# EAGLE design column_controller (EAGLE 9.6.0)
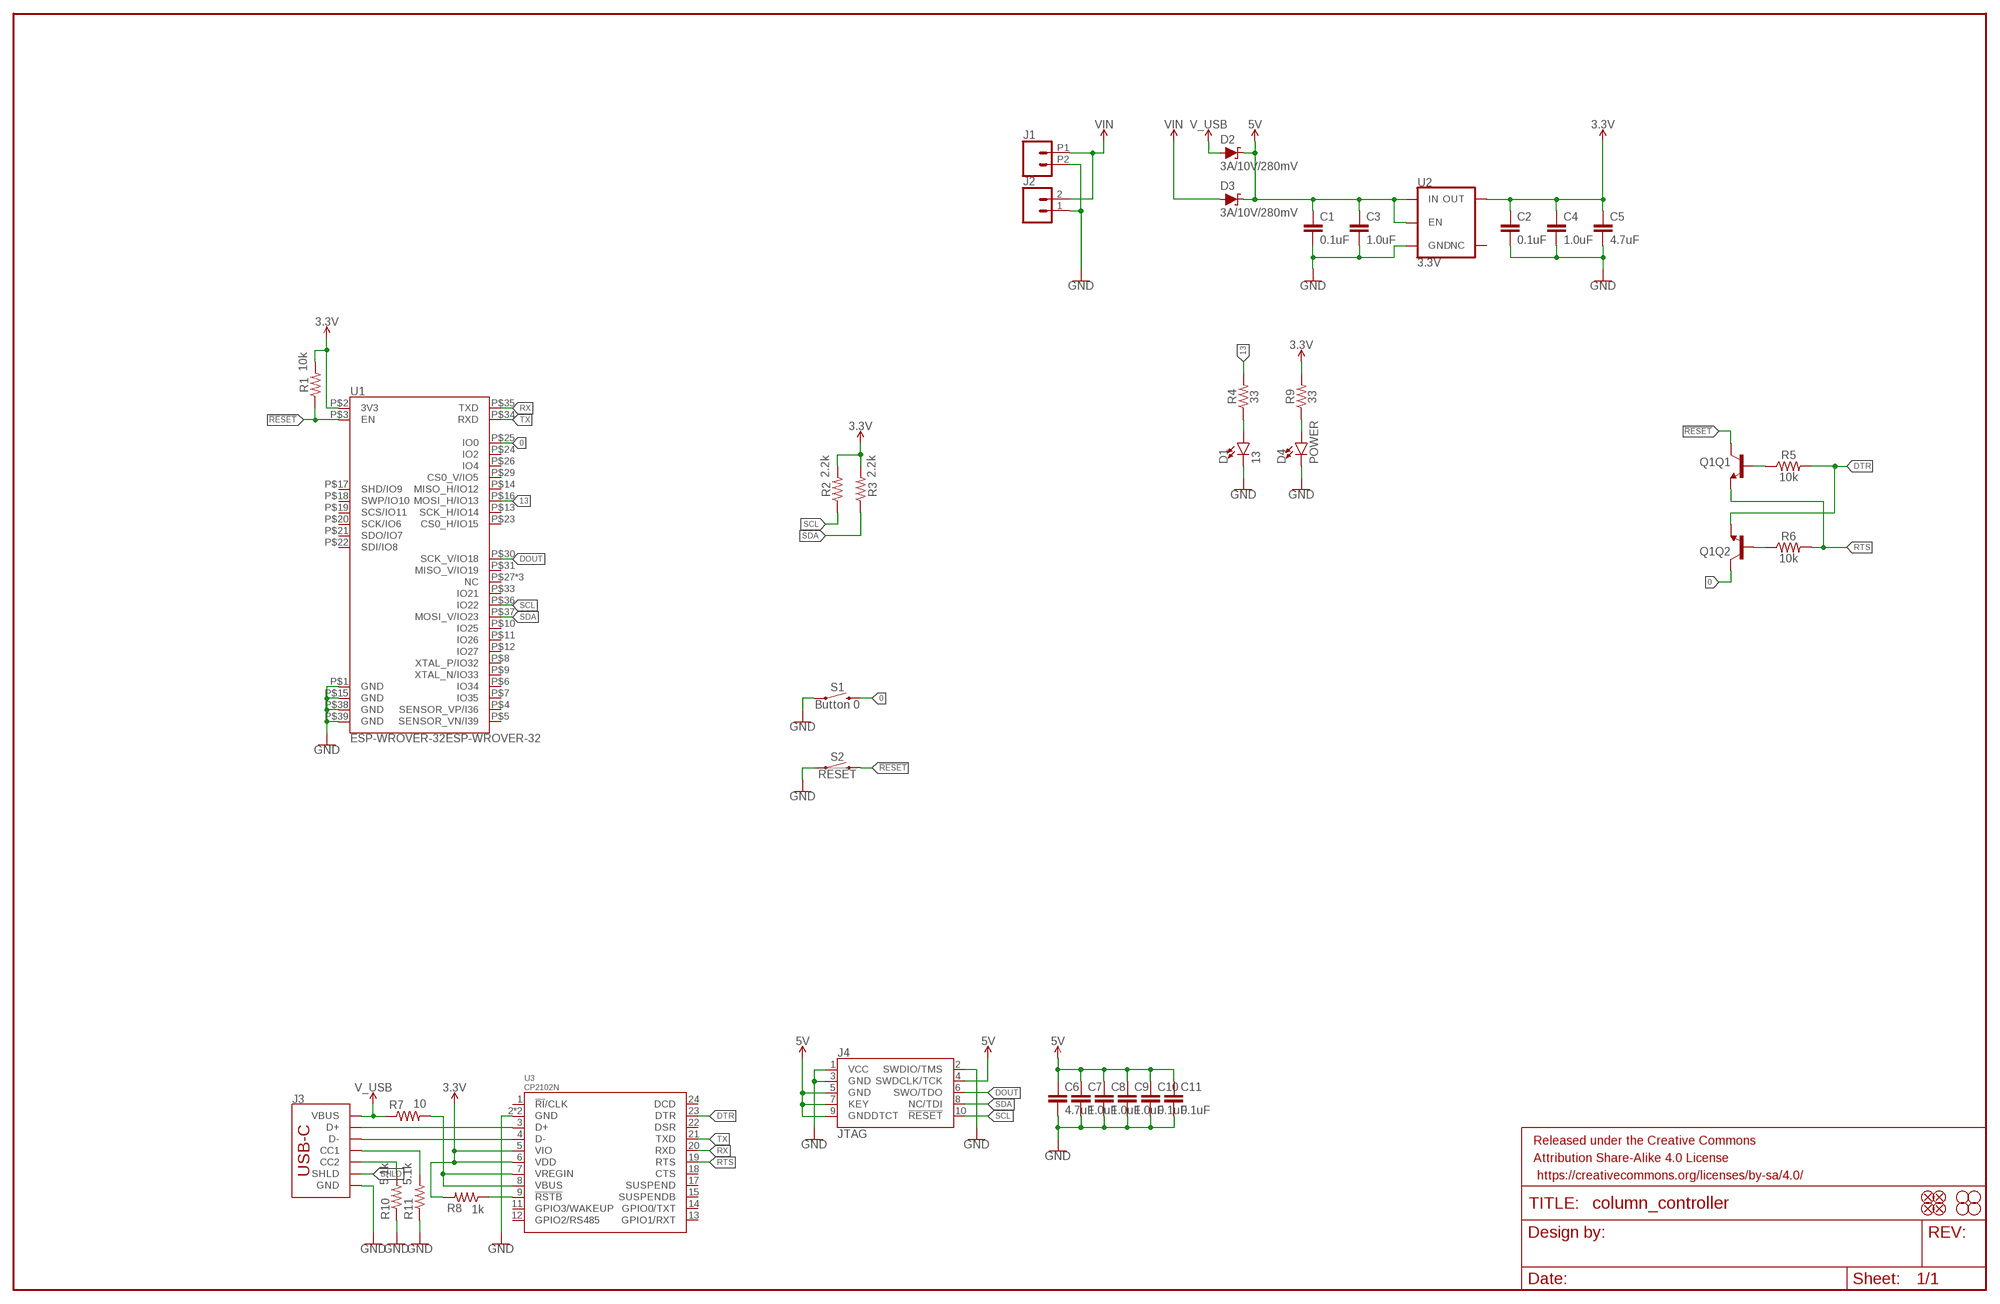
[diagram p0: schematic, sheet 1]

## Parts
C1  0.1uF  0.1UF-0603-25V-(+80/-20%)  [0603]
C2  0.1uF  0.1UF-0603-25V-(+80/-20%)  [0603]
C3  1.0uF  1.0UF-0603-16V-10%-X7R  [0603]
C4  1.0uF  1.0UF-0603-16V-10%-X7R  [0603]
C5  4.7uF  4.7UF-0603-35V-(20%)  [0603]
C6  4.7uF  4.7UF-0603-6.3V-(10%)  [0603]
C7  1.0uF  1.0UF-0603-16V-10%-X7R  [0603]
C8  1.0uF  1.0UF-0603-16V-10%-X7R  [0603]
C9  1.0uF  1.0UF-0603-16V-10%-X7R  [0603]
C10  0.1uF  0.1UF-0603-25V-(+80/-20%)  [0603]
C11  0.1uF  0.1UF-0603-25V-(+80/-20%)  [0603]
D1  13  LED-BLUE0603  [LED-0603]
D2  3A/10V/280mV  DIODE-SCHOTTKY-BAT60A  [SOD-323]
D3  3A/10V/280mV  DIODE-SCHOTTKY-BAT60A  [SOD-323]
D4  POWER  LED-RED0603  [LED-0603]
FD1  FIDUCIAL1X2  [FIDUCIAL-1X2]
FD2  FIDUCIAL1X2  [FIDUCIAL-1X2]
FD3  FIDUCIAL1X2  [FIDUCIAL-1X2]
FD4  FIDUCIAL1X2  [FIDUCIAL-1X2]
FRAME1  FRAME-LEDGER  [CREATIVE_COMMONS]
H1  STAND-OFF  [STAND-OFF]
H2  STAND-OFF  [STAND-OFF]
H3  STAND-OFF  [STAND-OFF]
H4  STAND-OFF  [STAND-OFF]
J1  CONN_02SCREWTERMINAL-6.35MM-2  [1X02_6.35_SCREWTERM]
J2  CONN_021X02_NO_SILK  [1X02_NO_SILK]
J3  USB_C_2-LAYER  [USB-C-16P]
J4  JTAG  CORTEX_JTAG_DEBUG_SMD  [2X5-SMD-1.27MM]
Q1  TRANS_NPN_DUAL-MBT3904DW1T1  [SC70-6]
R1  10k  10KOHM-0603-1/10W-1%  [0603]
R2  2.2k  2.2KOHM-0603-1/10W-1%  [0603]
R3  2.2k  2.2KOHM-0603-1/10W-1%  [0603]
R4  33  33OHM-0603-1/10W-1%  [0603]
R5  10k  10KOHM-0603-1/10W-1%  [0603]
R6  10k  10KOHM-0603-1/10W-1%  [0603]
R7  10  10OHM-0603-1/10W-1%  [0603]
R8  1k  1KOHM-0603-1/10W-1%  [0603]
R9  33  33OHM-0603-1/10W-1%  [0603]
R10  5.1k  5.1KOHM5.1KOHM-0603-1/10W-1%  [0603]
R11  5.1k  5.1KOHM5.1KOHM-0603-1/10W-1%  [0603]
S1  Button 0  MOMENTARY-SWITCH-SPST-SMD-4.6X2.8MM  [TACTILE_SWITCH_SMD_4.6X2.8MM]
S2  !RESET  MOMENTARY-SWITCH-SPST-SMD-4.6X2.8MM  [TACTILE_SWITCH_SMD_4.6X2.8MM]
U1  ESP-WROVER-32ESP-WROVER-32  [ESP-WROVER-32]
U2  3.3V  V_REG_AP2112K-3.3V  [SOT23-5]
U3  CP2102N  [QFN24]

## Nets
0: Q1.6(Q2:C) S1.3 S1.4 U1.P$25(IO0)
3.3V: C2.1 C4.1 C5.1 R1.2 R2.2 R3.2 R8.2 R9.2 U1.P$2(3V3) U2.5(OUT) U3.5(VIO) U3.6(VDD)
5V: C1.1 C3.1 C6.1 C7.1 C8.1 C9.1 C10.1 C11.1 D2.C D3.C J4.4(SWDCLK/TCK) J4.5(GND) J4.7(KEY) J4.9(GNDDTCT) U2.1(IN) U2.3(EN)
13: R4.2 U1.P$16(MOSI_H/IO13)
!RESET: Q1.3(Q1:C) R1.1 S2.3 S2.4 U1.P$3(EN)
DOUT: J4.6(SWO/TDO) U1.P$30(SCK_V/IO18)
DTR: Q1.1(Q2:E) R5.2 U3.23(DTR)
GND: C1.2 C2.2 C3.2 C4.2 C5.2 C6.2 C7.2 C8.2 C9.2 C10.2 C11.2 D1.C D4.C J1.P2 J2.1 J3.GND J3.GND2(GND) J4.1(VCC) J4.2(SWDIO/TMS) J4.3(GND) R10.1 R11.1 S1.1 S1.2 S2.1 S2.2 U1.P$1(GND) U1.P$15(GND) U1.P$38(GND) U1.P$39(GND) U2.2(GND) U3.2(GND) U3.PAD(GND)
N$1: J3.A7(D-) J3.B7(D-) U3.4(D-)
N$2: J3.A6(D+) J3.B6(D+) U3.3(D+)
N$3: Q1.2(Q2:B) R6.1
N$4: D1.A R4.1
N$5: Q1.5(Q1:B) R5.1
N$6: R7.2 U3.7(VREGIN) U3.8(VBUS)
N$7: R8.1 U3.9(!RSTB)
N$8: D4.A R9.1
N$10: J3.A5(CC1) R11.2
N$11: J3.B5(CC2) R10.2
RTS: Q1.4(Q1:E) R6.2 U3.19(RTS)
RX: U1.P$35(TXD) U3.20(RXD)
SCL: J4.10(!RESET) R2.1 U1.P$36(IO22)
SDA: J4.8(NC/TDI) R3.1 U1.P$37(MOSI_V/IO23)
SHLD: J3.SHLD1(SHLD) J3.SHLD2(SHLD) J3.SHLD3(SHLD) J3.SHLD4(SHLD) J3.SHLD5(SHLD) J3.SHLD6(SHLD) J3.SHLD7(SHLD) J3.SHLD8(SHLD)
TX: U1.P$34(RXD) U3.21(TXD)
V_USB: D2.A J3.VBUS1(VBUS) J3.VBUS2(VBUS) R7.1
VIN: D3.A J1.P1 J2.2
Unconnected: U1.P$4(SENSOR_VP/I36) U1.P$5(SENSOR_VN/I39) U1.P$6(IO34) U1.P$7(IO35) U1.P$8(XTAL_P/IO32) U1.P$9(XTAL_N/IO33) U1.P$10(IO25) U1.P$11(IO26) U1.P$12(IO27) U1.P$13(SCK_H/IO14) U1.P$14(MISO_H/IO12) U1.P$17(SHD/IO9) U1.P$18(SWP/IO10) U1.P$19(SCS/IO11) U1.P$20(SCK/IO6) U1.P$21(SDO/IO7) U1.P$22(SDI/IO8) U1.P$23(CS0_H/IO15) U1.P$24(IO2) U1.P$26(IO4) U1.P$27(NC) U1.P$28(NC) U1.P$29(CS0_V/IO5) U1.P$31(MISO_V/IO19) U1.P$32(NC) U1.P$33(IO21) U2.4(NC) U3.1(!RI!/CLK) U3.11(GPIO3/WAKEUP) U3.12(GPIO2/RS485) U3.13(GPIO1/RXT) U3.14(GPIO0/TXT) U3.15(SUSPENDB) U3.17(SUSPEND) U3.18(CTS) U3.22(DSR) U3.24(DCD)

## Library data of the parts
C1 C2 C10 C11 = SparkFun-Capacitors:0.1UF: 0.1µF ceramic capacitors A capacitor is a passive two-terminal electrical component used to store electrical energy temporarily in an electric field.; PROD_ID: CAP-00810
C3 C4 C7-C9 = SparkFun-Capacitors:1.0UF: 1µF ceramic capacitors A capacitor is a passive two-terminal electrical component used to store electrical energy temporarily in an electric field.; PROD_ID: CAP-13930
C5 = SparkFun-Capacitors:4.7UF: 4.7µF ceramic capacitors A capacitor is a passive two-terminal electrical component used to store electrical energy temporarily in an electric field.; PROD_ID: CAP-14106
C6 = SparkFun-Capacitors:4.7UF: 4.7µF ceramic capacitors A capacitor is a passive two-terminal electrical component used to store electrical energy temporarily in an electric field.; PROD_ID: CAP-08280
D1 = SparkFun-LED:LED-BLUE: Blue SMD LED Used in manufacturing of various products at SparkFun Packages: 0603 - SMD 0603 package [Product Link] <http://www.digikey.com/product-detail/en/SMLE12BC7TT86/511-1589-2-ND/1641808> 1206 - SMD1206 package [Product Link] <http://www.digikey.com/product-detail/en/lite-on-inc/LTST-C150TBKT/160-1643-1-ND/573584> SparkFun Products: ESP8266 Thing-Dev Board <https://www.sparkfun.com/products/13711> RedBoard <https://www.sparkfun.com/products/12757>; PROD_ID: DIO-08575; VALUE: BLUE
D2 D3 = SparkFun-DiscreteSemi:DIODE-SCHOTTKY: Schottky diode A Schottky diode is a semiconductor diode which has a low forward voltage drop and a very fast switching action.; PROD_ID: DIO-14072
D4 = SparkFun-LED:LED-RED: Red SMD LED Used in manufacturing of most products at SparkFun Packages: 0603 - SMD 0603 package [Product Link] <http://docs.avagotech.com/docs/AV02-0551EN> 0603 SMART - SMD 0603 SMART package ( more efficient and expensive)[Product Link] <http://www.osram-os.com/Graphics/XPic2/00077099_0.pdf> 1206 - SMD1206 package [Product Link] <https://www.sparkfun.com/datasheets/DevTools/LilyPad/Q150OVS4.pdff> SparkFun Products: Pro Mini 328 -5V <https://www.sparkfun.com/products/821> RedBoard <https://www.sparkfun.com/products/12757> IOIO-OTG <https://www.sparkfun.com/products/13613>; PROD_ID: DIO-00819; VALUE: RED
FD1-FD4 = SparkFun-Aesthetics:FIDUCIAL: Fiducial Alignment Points Point-of-reference for pick-and-place machines and other optical instruments.
FRAME1 = SparkFun-Aesthetics:FRAME-LEDGER: Schematic Frame - Ledger Standard 11x14 US Ledger frame
H1-H4 = SparkFun-Hardware:STAND-OFF: Stand Off Drill holes for mechanically mounting via screws, standoffs, etc. Note: Use the keepout ring to avoid running the screw head into surrounding components. Variant Overviews STAND-OFF - Mechanical footprint for a #4 phillips button head screw. STAND-OFF-TIGHT - Mechanical footprint for a #4 phillips button head screw, Example SparkFun Products Screw - Phillips Head (1/4", 4-40, 10 pack) <https://www.sparkfun.com/products/10453> (PRT-10453) Screw - Phillips Head (1/2", 4-40, 10 pack) <https://www.sparkfun.com/products/10452> (PRT-10452) Screw - Phillips Head (3/4", 4-40, 10 pack) <https://www.sparkfun.com/products/10451> (PRT-10451) Screw - Phillips Head (1", 4-40, 10 pack) <https://www.sparkfun.com/products/10450> (PRT-10450)
J1 J2 = SparkFun-Connectors:CONN_02: Multi connection point. Often used as Generic Header-pin footprint for 0.1 inch spaced/style header connections On any of the 0.1 inch spaced packages, you can populate with these: Break Away Headers - Straight <https://www.sparkfun.com/products/116> (PRT-00116) Break Away Male Headers - Right Angle <https://www.sparkfun.com/products/553> (PRT-00553) Female Headers <https://www.sparkfun.com/products/115> (PRT-00115) Break Away Headers - Machine Pin <https://www.sparkfun.com/products/117> (PRT-00117) Break Away Female Headers - Swiss Machine Pin <https://www.sparkfun.com/products/743> (PRT-00743) For SCREWTERMINALS and SPRING TERMINALS visit here: Screw Terimnals on SparkFun.com <https://www.sparkfun.com/search/results?term=Screw+Terminals> (5mm/3.5mm/2.54mm spacing) This device is also useful as a general connection point to wire up your design to another part of your project. Our various solder wires solder well into these plated through hole pads. Hook-Up Wire - Assortment (Stranded, 22 AWG) <https://www.sparkfun.com/products/11375> (PRT-11375) Hook-Up Wire - Assortment (Solid Core, 22 AWG) <https://www.sparkfun.com/products/11367> (PRT-11367) View the entire wire category on our website here <https://www.sparkfun.com/categories/141> Special notes: Molex polarized connector foot print use with: PRT-08233 with associated crimp pins and housings. 2.54_SCREWTERM for use with PRT-10571. 3.5mm Screw Terminal footprints for PRT-08084 5mm Screw Terminal footprints for use with PRT-08432
J3 = SparkFun-Connectors:USB_C: USB Type C 16Pin Connector Super Speed pins not available on the 16-pin purely SMD connector so this part is best for USB 2.0 implementations. D1 and D2 are tied together enabling D+/- no matter which way the cable is plugged into the connector. The two channel configuration pins (CC1/2) are exposed. These are normally connected to ground via 5.1k resistors but can be reconfigured for high current/high power applications.; PROD_ID: CONN-14122
J4 = SparkFun-Connectors:CORTEX_JTAG_DEBUG: Cortex Debug Connector - 10 pin Supports JTAG debug, Serial Wire debug, and Serial Wire Viewer. PTH and SMD connector options available. General Connector Information <http://infocenter.arm.com/help/topic/com.arm.doc.faqs/attached/13634/cortex_debug_connectors.pdf> Products: PTH Connector <http://www.digikey.com/product-detail/en/cnc-tech/3220-10-0100-00/1175-1627-ND/3883661> -via Digi-Key SparkFun PSoc <https://www.sparkfun.com/products/13229> SparkFun T <https://www.sparkfun.com/products/13810>; PROD_ID: CONN-14503
Q1 = SparkFun-DiscreteSemi:TRANS_NPN_DUAL: Dual NPN Transistors in Single Package The MBT3904W1 puts two general purpose 3904 NPN transistors in a single package. Datasheet <http://www.onsemi.com/pub_link/Collateral/MBT3904DW1T1-D.PDF> SparkFun Products: SparkFun ESP32 Thing <https://www.sparkfun.com/products/13907>; PROD_ID: TRANS-13337
R1 R5 R6 = SparkFun-Resistors:10KOHM: 10kΩ resistor A resistor is a passive two-terminal electrical component that implements electrical resistance as a circuit element. Resistors act to reduce current flow, and, at the same time, act to lower voltage levels within circuits. - Wikipedia; PROD_ID: RES-00824
R2 R3 = SparkFun-Resistors:2.2KOHM: 2.2kΩ resistor A resistor is a passive two-terminal electrical component that implements electrical resistance as a circuit element. Resistors act to reduce current flow, and, at the same time, act to lower voltage levels within circuits. - Wikipedia; PROD_ID: RES-08272
R4 R9 = SparkFun-Resistors:33OHM: 33Ω resistor A resistor is a passive two-terminal electrical component that implements electrical resistance as a circuit element. Resistors act to reduce current flow, and, at the same time, act to lower voltage levels within circuits. - Wikipedia; PROD_ID: RES-08270
R7 = SparkFun-Resistors:10OHM: 10Ω resistor A resistor is a passive two-terminal electrical component that implements electrical resistance as a circuit element. Resistors act to reduce current flow, and, at the same time, act to lower voltage levels within circuits. - Wikipedia; PROD_ID: RES-12581
R8 = SparkFun-Resistors:1KOHM: 1kΩ resistor A resistor is a passive two-terminal electrical component that implements electrical resistance as a circuit element. Resistors act to reduce current flow, and, at the same time, act to lower voltage levels within circuits. - Wikipedia; PROD_ID: RES-07856
R10 R11 = SparkFun-Resistors:5.1KOHM; PROD_ID: RES-12083
S1 S2 = SparkFun-Switches:MOMENTARY-SWITCH-SPST: Momentary Switch (Pushbutton) - SPST Normally-open (NO) SPST momentary switches (buttons, pushbuttons). Variants PTH-12MM - 12mm square, through-hole Momentary Pushbutton Switch - 12mm Square <https://www.sparkfun.com/products/9190> (COM-09190) PTH-6.0MM, PTH-6.0MM-KIT - 6.0mm square, through-hole Mini Pushbutton Switch <https://www.sparkfun.com/products/97> (COM-00097) KIT package intended for soldering kit's - only one side of pads' copper is exposed. PTH-RIGHT-ANGLE-KIT - Right-angle, through-hole Right Angle Tactile Button <https://www.sparkfun.com/products/10791> - Used on SparkFun BigTime Watch Kit <https://www.sparkfun.com/products/11734> SMD-12MM - 12mm square, surface-mount Tactile Button - SMD (12mm) <https://www.sparkfun.com/products/12993> (COM-12993) Used on SparkFun PicoBoard <https://www.sparkfun.com/products/11888> SMD-4.5MM - 4.5mm Square Trackball Switch Used on SparkFun Blackberry Trackballer Breakout <https://www.sparkfun.com/products/13169> SMD-4.6MMX2.8MM - 4.60mm x 2.80mm, surface mount Used on SparkFun SAMD21 Mini Breakout <https://www.sparkfun.com/products/13664> SMD-5.2MM, SMD-5.2-REDUNDANT - 5.2mm square, surface-mount Mini Pushbutton Switch - SMD <https://www.sparkfun.com/products/8720> (COM-08720) Used on Arduino Pro Mini <https://www.sparkfun.com/products/11114> REDUNDANT package connects both switch circuits together SMD-6.0X3.5MM - 6.0 x 3.5mm, surface mount Momentary Reset Switch SMD <https://www.sparkfun.com/products/8229> (COM-08229) SMD-6.2MM-TALL - 6.2mm square, surface mount Tactile Button - SMD (6mm) <https://www.sparkfun.com/products/12992> Used on SparkFun Digital Sandbox <https://www.sparkfun.com/products/12651> SMD-RIGHT-ANGLE - Right-angle, surface mount Used on SparkFun Block for Intel® Edison - Arduino <https://www.sparkfun.com/products/13036>; PROD_ID: SWCH-13065
U1 = SparkFun-RF:ESP-WROVER-32
U2 = SparkFun-IC-Power:V_REG_AP2112: AP2112 - 600mA CMOS LDO Regulator w/ Enable The AP2112 is CMOS process low dropout linear regulator with enable function, the regulator delivers a guaranteed 600mA (min.) continuous load current. Features Output Voltage Accuracy: ±1.5% Output Current: 600mA (Min.) Foldback Short Current Protection: 50mA Enable Function to Turn ON/OFF VOUT Low Dropout Voltage (3.3V): 250mV (Typ.) @IOUT=600mA Excellent Load Regulation: 0.2%/A (Typ.) Excellent Line Regulation: 0.02%/V (Typ.) Low Quiescent Current: 55μA (Typ.) Low Standby Current: 0.01μA (Typ.) Low Output Noise: 50μVRMS PSRR: 100Hz -65dB, 1kHz -65dB OTSD Protection Stable with 1.0μF Flexible Cap: Ceramic, Tantalum and Aluminum Electrolytic Operation Temperature Range: -40°C to 85°C ESD: MM 400V, HBM 4000V; PROD_ID: VREG-12457
U3 = SparkFun-IC-Comms:CP2102N; PROD_ID: IC-14020

## Board
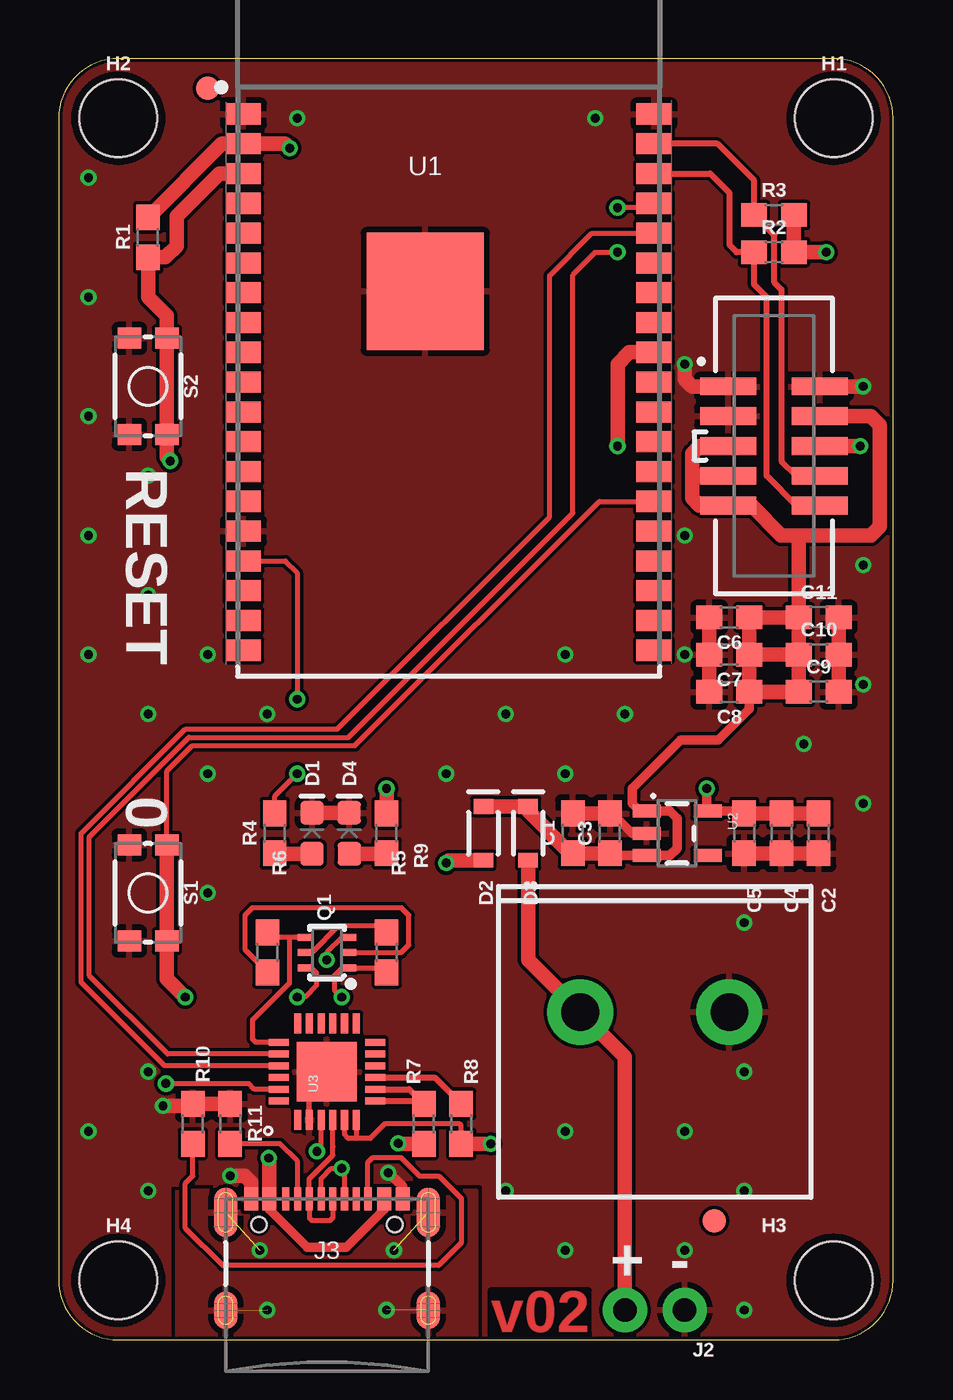
[diagram p1: board, top side]
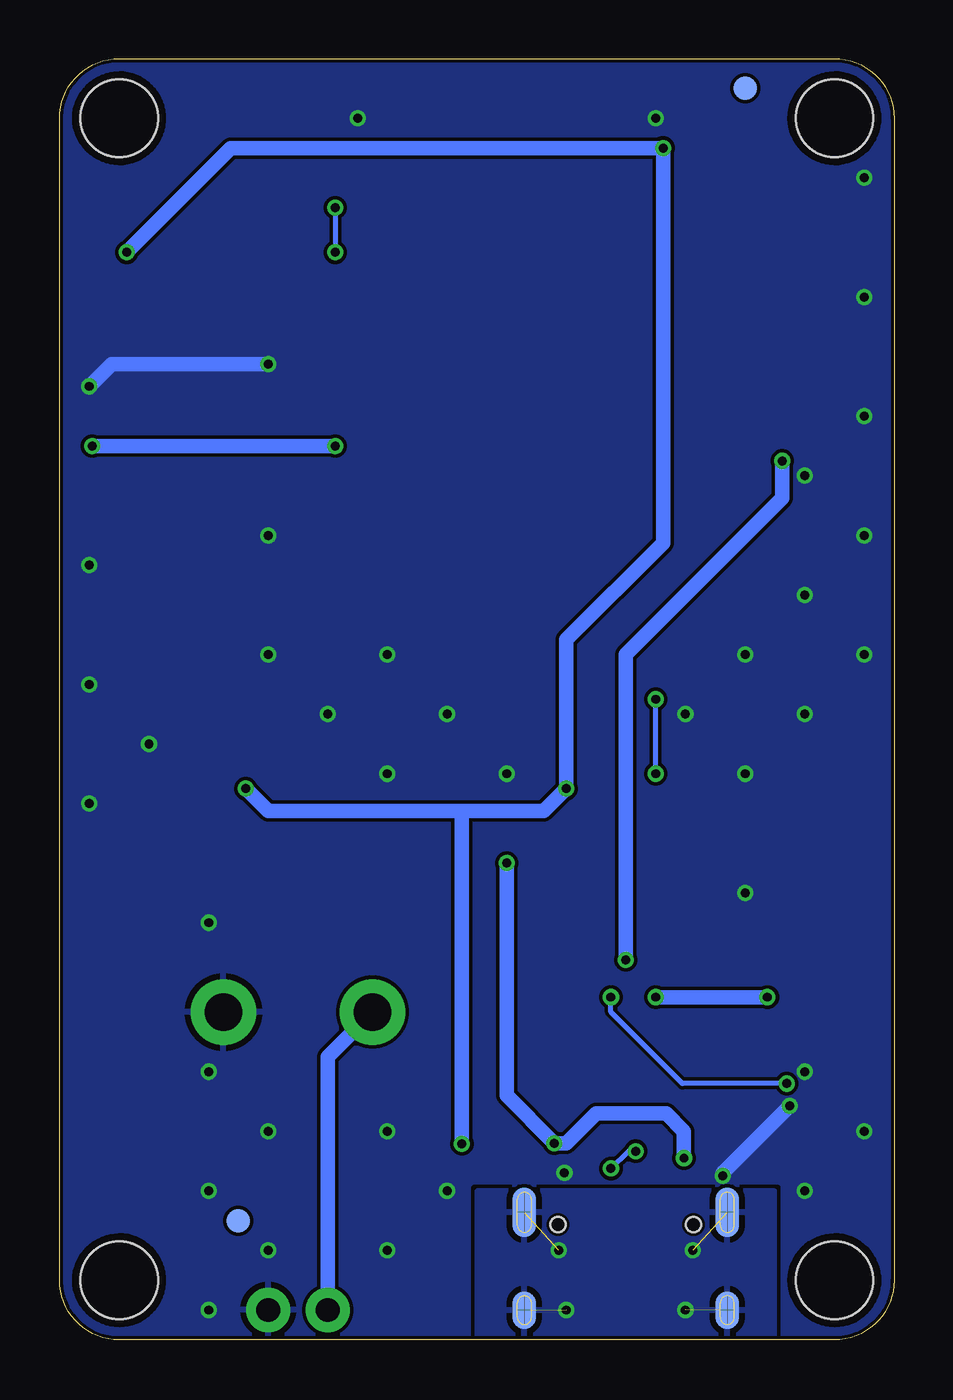
[diagram p2: board, bottom side, seen from below]

Size 35.56 x 54.61 mm. Coordinates in mm from the lower left corner, seen from the top.
Outline: 0,52.07 0,2.54 arc90 2.54,0 33.02,0 arc90 35.56,2.54 35.56,52.07 arc90 33.02,54.61 2.54,54.61 arc90 0,52.07
Copper layers (1*16): Top 0.035mm / dielectric 1.5mm / Bottom 0.035mm
Design rules "SparkFun-2-layer-PCBWay-LIMIT": minimum track width 6mil, minimum drill 0.3mm, track to track 6mil, track to pad 6mil, pad to pad 6mil, via to via 6mil, smd to smd 6mil, copper to edge 6mil, drill to drill 6mil, minimum pad ring 6mil, minimum via ring 6mil, stop-mask expansion 4mil, vias tented up to drill 25mil, thermal gap 10mil

### Footprints (pad centres in the part's own frame; a part is rotated, then mirrored left to right if it is on the bottom)
0603 = smd 1.1 x 1: 1 -0.85,0; 2 0.85,0
LED-0603 = smd 1 x 1: A -0.877,0; C 0.877,0
SOD-323 = smd 0.63 x 0.83: A 1.15,0; C -1.15,0
FIDUCIAL-1X2 = smd 1 x 1: 1 0,0
STAND-OFF = hole 3.302: 0,0
1X02_6.35_SCREWTERM = drill 1.6 pad 2.8: P1 -3.175,0; P2 3.175,0
1X02_NO_SILK = drill 1.016 pad 1.88: 1 0,0; 2 2.54,0
USB-C-16P = smd 0.3 x 1: A5 -1.25,-0.34; A6 -0.25,-0.34; A7 0.25,-0.34; A8 1.25,-0.34; B5 1.75,-0.34; B6 0.75,-0.34; B7 -0.75,-0.34; B8 -1.75,-0.34 | smd 0.6 x 1: GND -3.225,-0.34; GND2 3.225,-0.34; VBUS1 -2.45,-0.34; VBUS2 2.45,-0.34 | smd 1 x 2.1: SHLD1 -4.32,-0.915; SHLD2 4.32,-0.915 | smd 1 x 2.1 bottom: SHLD3 -4.32,-0.915; SHLD4 4.32,-0.915 | smd 1 x 1.6: SHLD5 -4.32,-5.095; SHLD8 4.32,-5.095 | smd 1 x 1.6 bottom: SHLD6 -4.32,-5.095; SHLD7 4.32,-5.095 | hole 0.65: -2.89,-1.445; 2.89,-1.445
2X5-SMD-1.27MM = smd 0.76 x 2.4: 1 2.54,1.95; 2 2.54,-1.95; 3 1.27,1.95; 4 1.27,-1.95; 5 0,1.95; 6 0,-1.95; 7 -1.27,1.95; 8 -1.27,-1.95; 9 -2.54,1.95; 10 -2.54,-1.95
SC70-6 = smd 0.3 x 0.66: 1 -0.65,-0.92; 2 0,-0.92; 3 0.65,-0.92; 4 0.65,0.92; 5 0,0.92; 6 -0.65,0.92
TACTILE_SWITCH_SMD_4.6X2.8MM = smd 0.9 x 1: 1 -2.05,-0.8; 2 2.05,-0.8; 3 2.05,0.8; 4 -2.05,0.8
ESP-WROVER-32 = smd 1.5 x 0.9: P$1 0.25,-7.44; P$2 0.25,-8.71; P$3 0.25,-9.98; P$4 0.25,-11.25; P$5 0.25,-12.52; P$6 0.25,-13.79; P$7 0.25,-15.06; P$8 0.25,-16.33; P$9 0.25,-17.6; P$10 0.25,-18.87; P$11 0.25,-20.14; P$12 0.25,-21.41; P$13 0.25,-22.68; P$14 0.25,-23.95; P$15 0.25,-25.22; P$16 0.25,-26.49; P$17 0.25,-27.76; P$18 0.25,-29.03; P$19 0.25,-30.3; P$20 17.75,-30.3; P$21 17.75,-29.03; P$22 17.75,-27.76; P$23 17.75,-26.49; P$24 17.75,-25.22; P$25 17.75,-23.95; P$26 17.75,-22.68; P$27 17.75,-21.41; P$28 17.75,-20.14; P$29 17.75,-18.87; P$30 17.75,-17.6; P$31 17.75,-16.33; P$32 17.75,-15.06; P$33 17.75,-13.79; P$34 17.75,-12.52; P$35 17.75,-11.25; P$36 17.75,-9.98; P$37 17.75,-8.71; P$38 17.75,-7.44 | smd 5 x 5: P$39 8,-15
SOT23-5 = smd 0.55 x 1.2: 1 -0.95,-1.3; 2 0,-1.3; 3 0.95,-1.3; 4 0.95,1.3; 5 -0.95,1.3
QFN24 = smd 0.85 x 0.3: 1 -2.05,1.25; 2 -2.05,0.75; 3 -2.05,0.25; 4 -2.05,-0.25; 5 -2.05,-0.75; 6 -2.05,-1.25; 13 2.05,-1.25; 14 2.05,-0.75; 15 2.05,-0.25; 16 2.05,0.25; 17 2.05,0.75; 18 2.05,1.25 | smd 0.3 x 0.85: 7 -1.25,-2.05; 8 -0.75,-2.05; 9 -0.25,-2.05; 10 0.25,-2.05; 11 0.75,-2.05; 12 1.25,-2.05; 19 1.25,2.05; 20 0.75,2.05; 21 0.25,2.05; 22 -0.25,2.05; 23 -0.75,2.05; 24 -1.25,2.05 | smd 2.55 x 2.55: PAD 0,0

### Placement (x,y rotation side)
C1  21.91,21.59 90 top
C2  32.38,21.59 270 top
C3  23.5,21.59 90 top
C4  30.8,21.59 270 top
C5  29.21,21.59 270 top
C6  28.57,30.8 180 top
C7  28.57,29.21 180 top
C8  28.57,27.62 180 top
C9  32.38,27.62 0 top
C10  32.38,29.21 0 top
C11  32.38,30.8 0 top
D1  10.79,21.59 90 top
D2  18.1,21.59 270 top
D3  20,21.59 270 top
D4  12.38,21.59 90 top
FD1  6.35,53.34 0 top
FD2  27.94,5.08 0 top
FD3  27.94,5.08 0 bottom
FD4  6.35,53.34 0 bottom
FRAME1  21.59,-8.89 0 top  (outside the outline)
H1  33.02,52.07 0 top
H2  2.54,52.07 0 top
H3  33.02,2.54 0 top
H4  2.54,2.54 0 top
J1  25.4,13.97 0 top
J2  26.67,1.27 180 top
J3  11.43,6.35 0 top
J4  30.48,38.1 90 top
Q1  11.43,16.51 90 top
R1  3.81,46.99 90 top
R2  30.48,46.35 0 top
R3  30.48,47.94 0 top
R4  9.21,21.59 90 top
R5  13.97,16.51 270 top
R6  8.89,16.51 90 top
R7  15.56,9.21 90 top
R8  17.14,9.21 270 top
R9  13.97,21.59 90 top
R10  5.71,9.21 270 top
R11  7.3,9.21 270 top
S1  3.81,19.05 270 top
S2  3.81,40.64 270 top
U1  7.62,59.69 0 top
U2  26.35,21.59 270 top
U3  11.43,11.43 90 top

### Tracks (layer width: path | path; a pad name or v marks a point on that pad's centre or on a via)
0  (via drill 0.38)
  Top 0.203: Q1.6 10.77,15.86 10.99,15.65 10.99,15.11 10.48,14.61 v10.16,14.61 | S1.4 4.61,24.24 5.69,25.32 12.62,25.32 23.04,35.74 U1.P$25
  Top 0.61: S1.4 S1.3 4.61,15.39 v5.4,14.61
  Bottom 0.61: v10.16,14.61 v5.4,14.61
3.3V  (via drill 0.38)
  Top 0.203: R8.2 17.14,9.14 17.09,9.2 13.89,9.2 13.28,8.59 12.7,8.59 | 12.7,8.59 12.34,8.59 12.18,8.75 U3.5 | U3.6 12.68,8.61 12.7,8.59
  Top 0.406: C5.1 29.11,22.54 U2.5 27.62,22.57 v27.62,23.5
  Top 0.61: C2.1 C4.1 C5.1 | R8.2 v18.41,8.36 | R9.2 v13.97,23.5 | R1.2 6.95,50.98 U1.P$2 9.66,50.98 v9.84,50.8 | R3.2 R2.2 v32.7,46.35
  Bottom 0.61: v32.7,46.35 28.26,50.8 v9.84,50.8 9.84,33.97 13.97,29.84 v13.97,23.5 14.92,22.54 18.41,22.54 | 18.41,22.54 26.67,22.54 v27.62,23.5 | v18.41,8.36 18.41,22.54
5V
  Top 0.406: C3.1 23.59,20.64 U2.3 26.04,20.64 26.35,20.95 26.35,22.23 26.04,22.54 U2.1 24.77,22.54 24.45,22.86 24.45,23.5 26.51,25.56 28.1,25.56 29.43,26.89 C8.1
  Top 0.61: C3.1 C1.1 21.8,20.74 20,22.54 D3.C D2.C | J4.5 27.3,38.1 26.99,37.78 26.99,36.83 | 26.99,36.83 26.99,35.88 27.3,35.56 J4.9 29.53,35.56 30.8,34.29 31.54,34.29 | J4.7 26.99,36.83 | J4.4 34.61,39.37 34.99,38.99 34.99,34.67 34.61,34.29 31.54,34.29 | C7.1 C6.1 C11.1 | C7.1 C8.1 C9.1 C10.1 | C10.1 C11.1 | C11.1 31.54,34.29 | C7.1 C10.1
13  (via drill 0.38)
  Top 0.203: R4.2 9.21,23.18 v10.16,24.13 | v10.16,27.3 10.16,32.7 9.66,33.2 U1.P$16
  Bottom 0.203: v10.16,24.13 v10.16,27.3
!RESET  (via drill 0.38)
  Top 0.203: Q1.3 12.08,17.16 11.43,16.51 v11.43,16.19 | 4.61,42.55 S2.4
  Top 0.61: U1.P$3 6.85,49.71 5.03,47.89 5.03,46.62 4.55,46.14 R1.1 3.81,44.45 4.61,43.65 4.61,42.55 | S2.4 S2.3 4.61,37.62 v4.76,37.47
  Bottom 0.61: v4.76,37.47 4.76,35.88 11.43,29.21 v11.43,16.19
DOUT  (via drill 0.38)
  Top 0.61: J4.6 v34.16,38.1 | U1.P$30 24.31,42.09 23.81,41.59 v23.81,38.1
  Bottom 0.61: v34.16,38.1 v23.81,38.1
DTR  (via drill 0.38)
  Top 0.203: U3.23 8.34,10.68 8.1,10.92 v4.57,10.92 | R5.2 13.77,15.86 Q1.1 12.09,15.86 11.75,15.52 11.75,14.92 v12.06,14.61
  Bottom 0.203: v4.57,10.92 9.02,10.92 12.06,13.97 v12.06,14.61
GND  (via drill 0.38)
  Top 0.203: U3.2 10.68,10.68 U3.PAD
  Top 0.406: U2.2 24.45,21.59 23.6,22.44 C3.2 | v14.05,7.11 14.29,6.87 14.33,6.87 14.65,6.54 J3.GND2
  Top 0.61: C5.2 C4.2 C2.2 | C3.2 C1.2 | J3.GND 8.21,6.72 7.94,6.99 v7.3,6.99 | R11.1 R10.1 5.63,9.97 v4.45,9.97 | D1.C D4.C | J4.2 v34.29,40.64 | J4.3 27.94,39.37 | C6.2 C7.2 C8.2 | C11.2 C10.2 C9.2 | J4.1 26.99,40.64 26.67,40.96 v26.67,41.59
  Bottom 0.61: v7.3,6.99 7.3,7.11 v4.45,9.97 | v34.29,40.64 33.34,41.59 v26.67,41.59
  other vias: 10.16,52.07 22.86,52.07 1.27,49.53 1.27,44.45 1.27,39.37 3.81,36.83 1.27,34.29 3.81,31.75 1.27,29.21 3.81,26.67 6.35,29.21 8.89,26.67 6.35,24.13 6.35,19.05 16.51,24.13 19.05,26.67 21.59,24.13 21.59,29.21 24.13,26.67 26.67,29.21 31.75,25.4 34.29,27.94 34.29,22.86 26.67,34.29 34.29,33.02 29.21,17.78 29.21,11.43 21.59,8.89 26.67,8.89 29.21,6.35 26.67,3.81 19.05,6.35 21.59,3.81 29.21,1.27 3.81,6.35 3.81,11.43 1.27,8.89
  pour Bottom (isolate 0.051, rank 2): 0,0 0,54.61 35.56,54.61 35.56,0
  pour Top (isolate 0.051, rank 2): 0,0 0,54.61 35.56,54.61 35.56,0
N$1
  Top 0.203: J3.A7 11.68,5.2 11.56,5.08 10.79,5.08 10.68,5.2 J3.B7 10.68,6.87 11.68,7.87 11.68,8.23 U3.4
N$2  (via drill 0.38)
  Top 0.203: J3.A6 11.18,6.86 11.62,7.3 v12.06,7.3 12.18,7.19 J3.B6 | v11.01,8.04 11.18,8.21 11.18,8.57 U3.3
  Bottom 0.203: v12.06,7.3 11.32,8.04 v11.01,8.04
N$3
  Top 0.203: Q1.2 14.61,16.51 14.92,16.83 14.92,18.1 14.61,18.41 8.26,18.41 7.94,18.1 7.94,16.64 8.89,15.68 R6.1
N$4
  Top 0.61: D1.A 9.23,20.71 R4.1
N$5
  Top 0.203: Q1.5 10.8,16.51 11.94,17.65 13.72,17.65 13.97,17.4 R5.1
N$6
  Top 0.254: U3.8 14.94,10.68 R7.2 15.44,10.18 U3.7
N$7
  Top 0.254: U3.9 16.02,11.18 R8.1
N$8
  Top 0.61: D4.A 13.94,20.71 R9.1
N$10
  Top 0.203: J3.A5 10.18,7.6 9.42,8.36 R11.2
N$11
  Top 0.203: R10.2 5.71,6.99 5.4,6.67 5.4,4.76 6.99,3.17 16.19,3.17 17.14,4.13 17.14,6.03 16.19,6.99 15.37,6.99 14.58,7.77 13.39,7.77 13.18,7.57 J3.B5
RTS
  Top 0.203: U3.19 8.4,12.68 8.26,12.83 8.26,13.62 9.84,15.2 9.84,17.16 | Q1.4 9.84,17.16 | 9.84,17.16 9.09,17.16 R6.2
RX  (via drill 0.38)
  Top 0.203: U1.P$35 25.19,48.26 v23.81,48.26 | v23.81,46.35 22.86,46.35 21.91,45.4 21.91,35.24 12.34,25.68 5.54,25.68 1.31,21.44 1.31,15.52 4.65,12.18 U3.20
  Bottom 0.203: v23.81,48.26 v23.81,46.35
SCL
  Top 0.254: J4.10 31.43,35.56 30.16,36.83 30.16,44.45 29.63,44.98 R2.1 28.89,46.35 28.57,46.67 28.57,48.9 27.76,49.71 U1.P$36
SDA
  Top 0.254: J4.8 31.43,36.83 30.8,37.47 30.8,44.77 30.5,45.06 30.5,47.07 R3.1 29.63,49.43 28.08,50.98 U1.P$37
SHLD  (via drill 0.38)  (8 unrouted)
  other vias: 8.89,1.27 13.97,1.27 8.57,3.81 14.29,3.81
  pour Top (isolate 0.051): 5.08,0 5.08,6.35 17.78,6.35 17.78,0
  pour Bottom (isolate 0.051): 5.08,0 5.08,6.35 17.78,6.35 17.78,0
TX
  Top 0.203: U1.P$34 22.72,47.17 20.92,45.36 20.92,35.07 11.88,26.04 5.4,26.04 0.95,21.59 0.95,15.24 4.51,11.68 U3.21
V_USB  (via drill 0.38)
  Top 0.406: J3.VBUS1 8.98,5.56 10.6,3.94 12.26,3.94 13.88,5.56 J3.VBUS2
  Top 0.61: J3.VBUS1 8.98,7.72 v8.95,7.75 | v16.51,20.32 16.63,20.44 D2.A | R7.1 14.5,8.36 v14.48,8.38
  Bottom 0.61: v8.95,7.75 8.95,8.89 9.72,9.65 12.7,9.65 13.97,8.38 v14.48,8.38 16.51,10.41 v16.51,20.32
VIN
  Top 0.61: D3.A 20,16.19 J1.P1 24.13,12.06 J2.2
  Bottom 0.61: J2.2 24.13,12.06 J1.P1

### Text on the board
Top: v02
tPlace: RESET | 0 | + | -